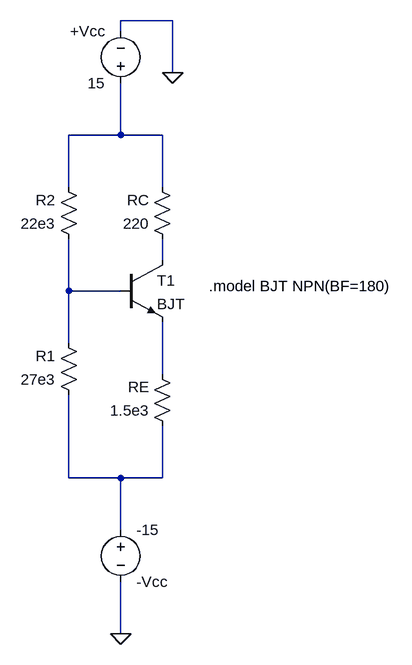
[diagram p0: schematic faz2A_DC_eqv.asc]
faz2A_DC_eqv.asc, the LTspice schematic file:
Version 4
SHEET 1 956 768
WIRE 64 -304 -16 -304
WIRE -16 -288 -16 -304
WIRE 64 -224 64 -304
WIRE -16 -128 -16 -208
WIRE -16 -128 -96 -128
WIRE 48 -128 -16 -128
WIRE -96 -48 -96 -128
WIRE 48 -48 48 -128
WIRE 48 64 48 32
WIRE -96 112 -96 32
WIRE -16 112 -96 112
WIRE -96 192 -96 112
WIRE 48 240 48 160
WIRE -96 400 -96 272
WIRE -16 400 -96 400
WIRE 48 400 48 320
WIRE 48 400 -16 400
WIRE -16 480 -16 400
WIRE -16 640 -16 560
FLAG 64 -224 0
FLAG -16 640 0
SYMBOL res -80 48 R180
WINDOW 0 36 76 Left 2
WINDOW 3 36 40 Left 2
SYMATTR InstName R2
SYMATTR Value 22e3
SYMBOL res -80 288 R180
WINDOW 0 36 76 Left 2
WINDOW 3 36 40 Left 2
SYMATTR InstName R1
SYMATTR Value 27e3
SYMBOL npn -16 64 R0
SYMATTR InstName T1
SYMATTR Value BJT
SYMBOL res 64 48 R180
WINDOW 0 36 76 Left 2
WINDOW 3 36 40 Left 2
SYMATTR InstName RC
SYMATTR Value 220
SYMBOL res 64 336 R180
WINDOW 0 36 76 Left 2
WINDOW 3 36 40 Left 2
SYMATTR InstName RE
SYMATTR Value 1.5e3
SYMBOL voltage -16 464 R0
WINDOW 0 24 96 Left 2
WINDOW 3 24 16 Left 2
WINDOW 123 0 0 Left 0
WINDOW 39 0 0 Left 0
SYMATTR InstName -Vcc
SYMATTR Value -15
SYMBOL voltage -16 -192 R180
WINDOW 0 24 96 Left 2
WINDOW 3 24 16 Left 2
WINDOW 123 0 0 Left 0
WINDOW 39 0 0 Left 0
SYMATTR InstName +Vcc
SYMATTR Value 15
TEXT 120 104 Left 2 !.model BJT NPN(BF=180)

The netlist it stands for:
* faz2A_DC_eqv.asc
R2 N003 N001 22e3
R1 N005 N003 27e3
Q§T1 N002 N003 N004 0 BJT
RC N002 N001 220
RE N005 N004 1.5e3
V§-Vcc N005 0 -15
V§+Vcc N001 0 15
.model NPN NPN
.model PNP PNP
.lib standard.bjt
.model BJT NPN(BF=180)
.backanno
.end